# Altium project mag_pos_connect.PrjPcb
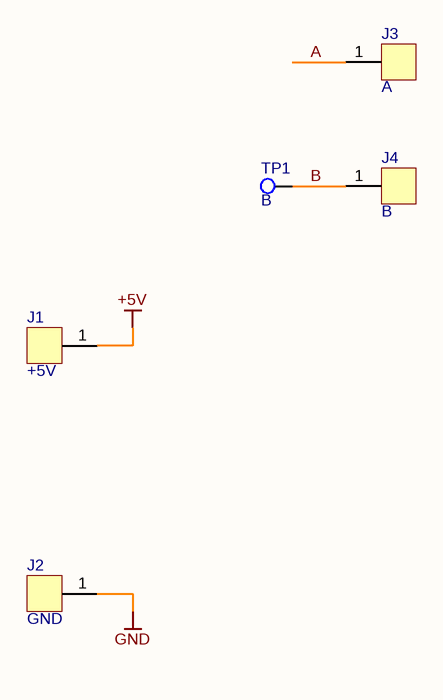
[diagram p0: mag_pos_connect.SchDoc]
1 sheet, 5 parts. Net scope: global (net labels, ports and power ports of the same name join across sheets).
Board file: mag_pos_connect.PcbDoc

## Sheet mag_pos_connect.SchDoc
size A4

### Parts
J1  +5V  [WIRE_1MM_1.5MM_THT]
J2  GND  [WIRE_1MM_1.5MM_THT]
J3  A  [WIRE_1MM_1.5MM_THT]
J4  B  [WIRE_1MM_1.5MM_THT]
TP1  B  [TP_SMD_1MM]

### Nets
+5V: J1.1
GND: J2.1
A: J3.1
B: J4.1 TP1.1

### Library data of the parts
J1-J4 = Wire_1MM: 1mm Wire; System: Connector
TP1 = TP_SMD_1mm: Testpoint SMD 1mm